# EasyEDA schematic wifi+lora_external.json
TITLE: Sheet_1; REV: 1.0; Date: 2025-01-19; Sheet: 1/1; Company: NotyCircuits
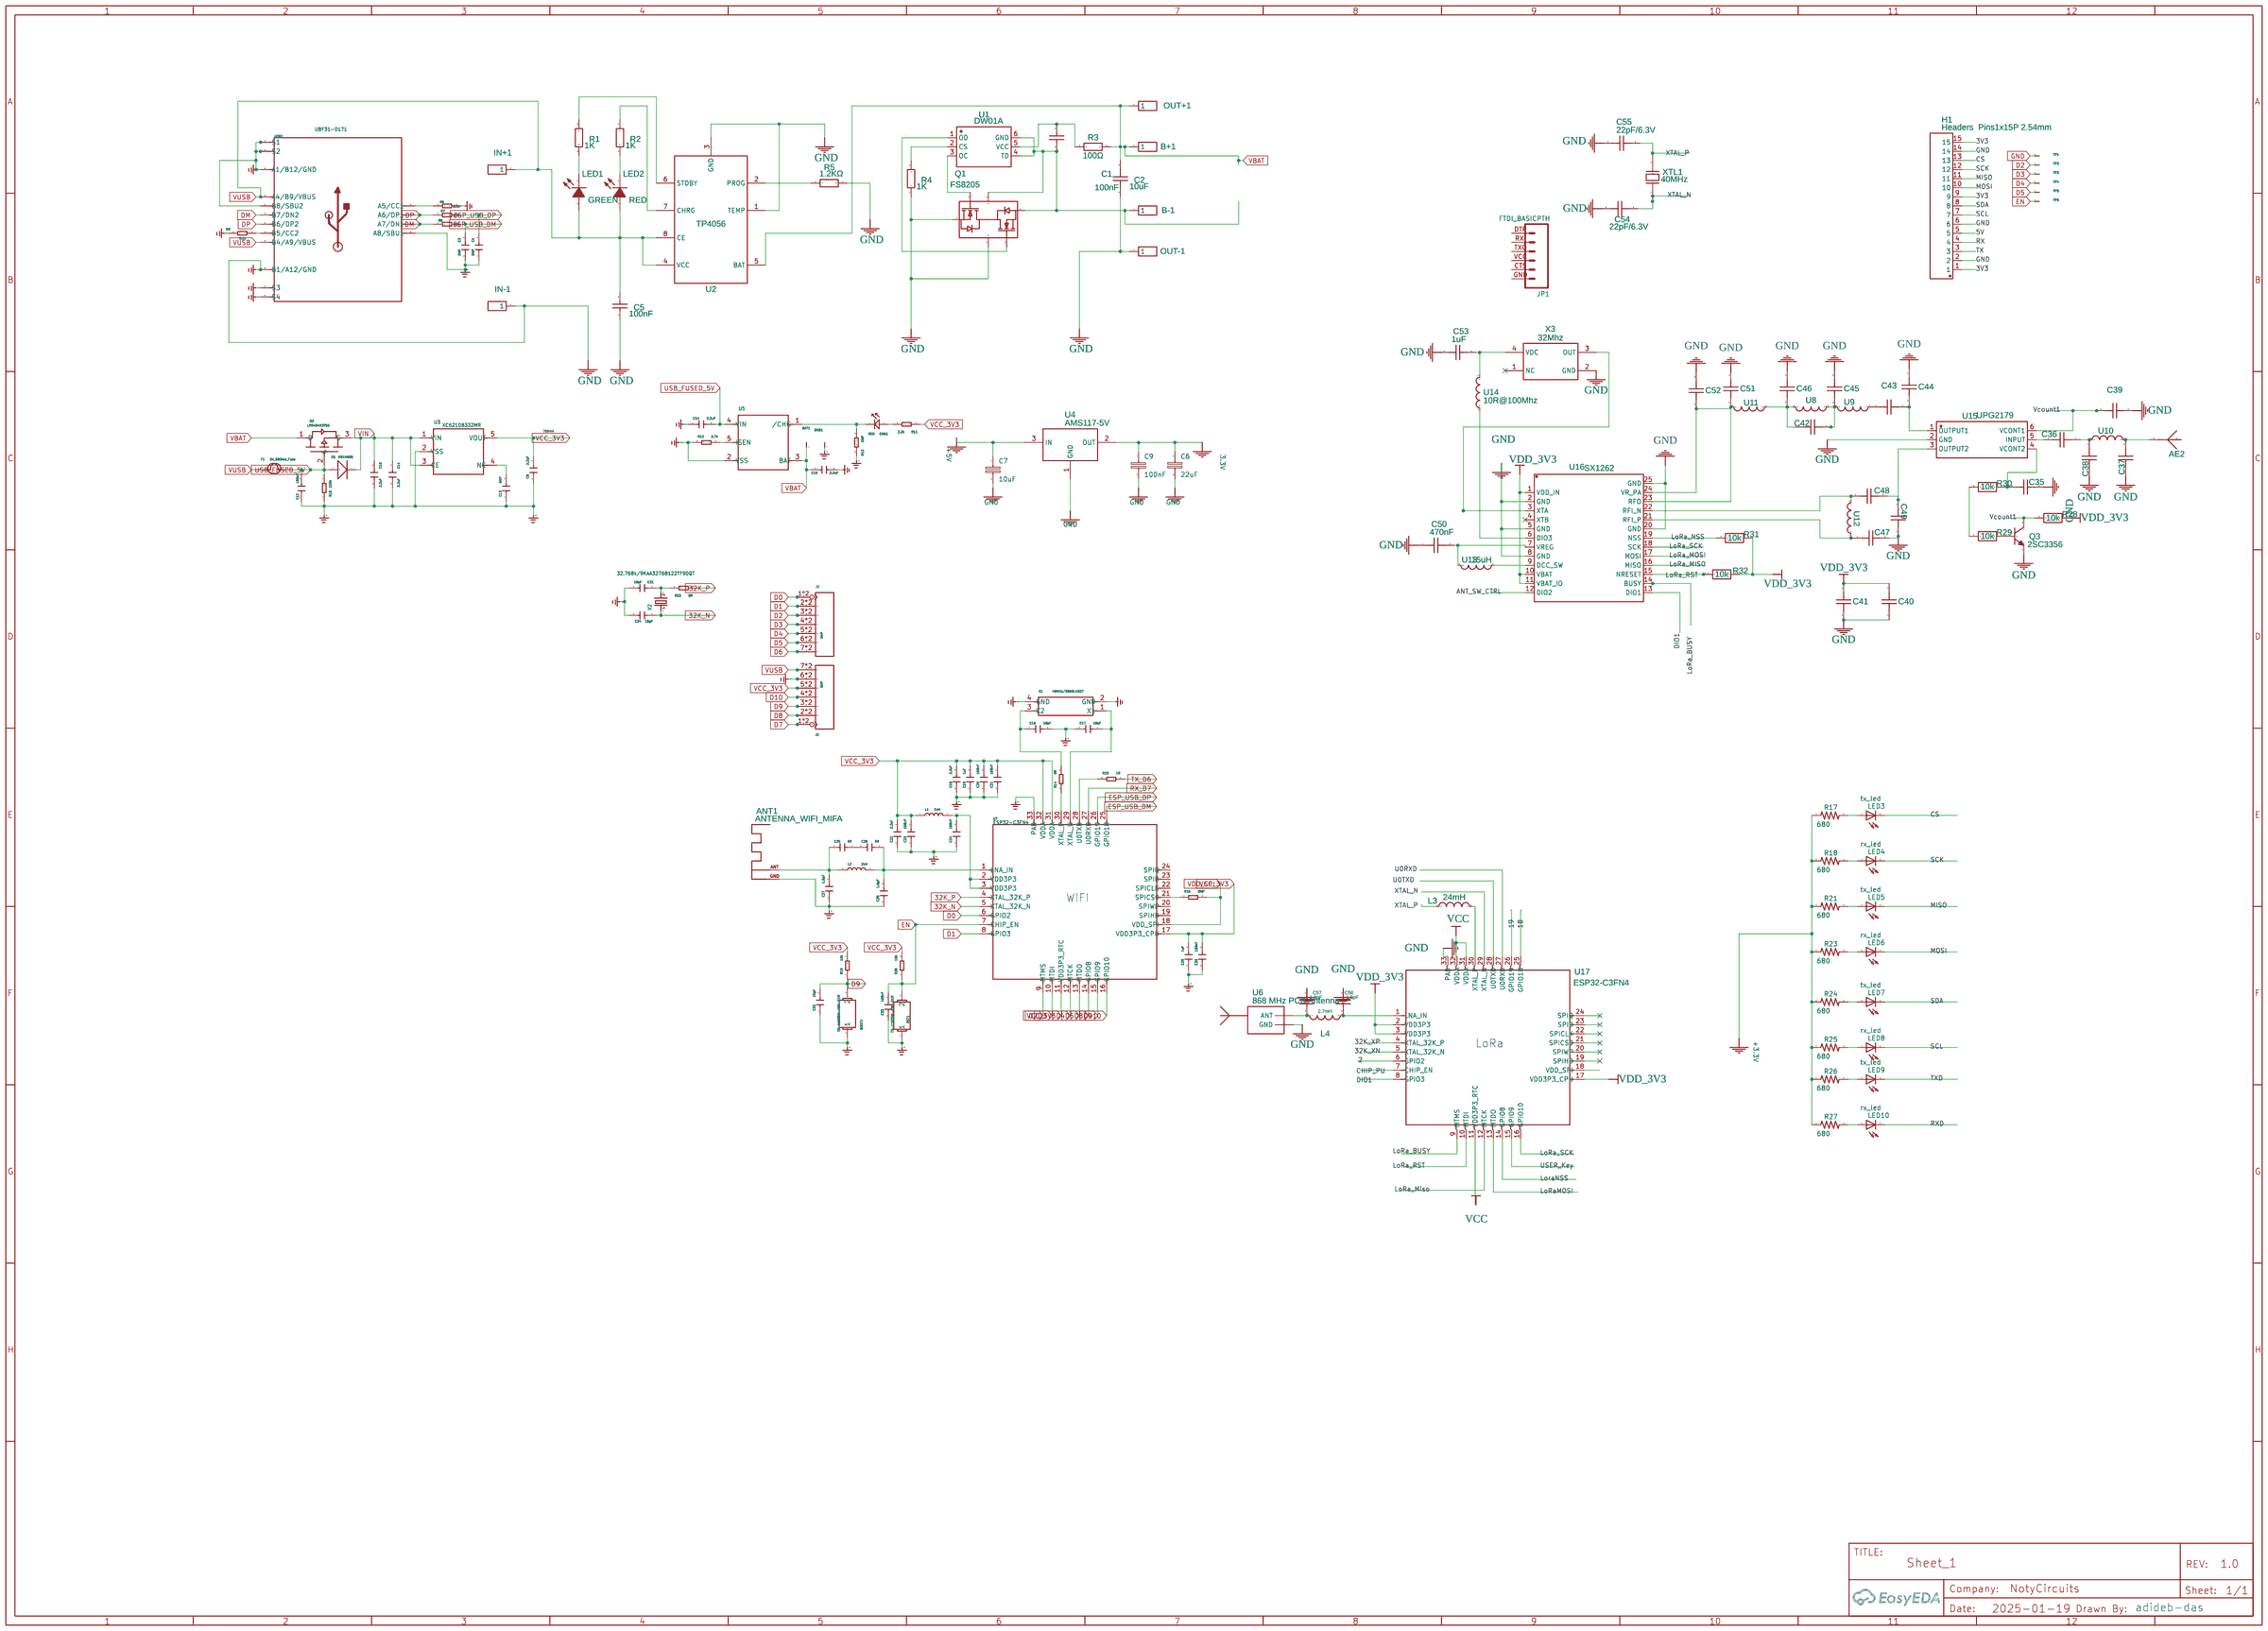
[diagram p0: schematic sheet]

## Parts
AE2  2450AT18A100E  [ANT-SMD_L3.2-W1.6]
ANT1  ANTENNA_WIFI_MIFA  [WIFI ANTENNA MIFA INVERTED F ANTENNA]
B+1  Header-Male-2.54_1x1  [HDR-1X1/2.54]
B-1  Header-Male-2.54_1x1  [HDR-1X1/2.54]
BAT1  DNP  [TP-80X40MIL]
BOOT1  TD-1183SN-A3N-D1R  [BUTTON_TD1183SA]
C1  100nF  [0603]
C2  10uF  [0603]
C3  DNP  [C0201]
C4  DNP  [C0201]
C5  100nF  [0603]
C6  22uF  [C3216]
C7  10uF  [C3216]
C8  2.2uF  [C0201]
C9  100nF  [0603-CAP]
C10  2.2uF  [C0201]
C11  2.2uF  [C0201]
C12  100nF  [C0201]
C13  DNP  [C0201]
C14  2.2uF  [C0201]
C15  2.2uF  [C0201]
C16  18pF  [C0201]
C17  18pF  [C0201]
C18  2.2uF  [C0201]
C19  1uF  [C0201]
C20  100nF  [C0201]
C21  100nF  [C0201]
C22  2.2uF  [C0201]
C23  100nF  [C0201]
C24  100nF  [C0201]
C25  0R  [C0201]
C26  0R  [C0201]
C27  1.6pF  [C0201]
C28  1.6pF  [C0201]
C29  1uF  [C0201]
C30  100nF  [C0201]
C31  18pF  [C0201]
C32  10pF  [C0201]
C33  100nF  [C0201]
C34  18pF  [C0201]
C35  1uF  [CAP-TH_L17.0-W8.5-P15.00-D1.2-FD]
C36  1uF  [CAP-TH_L17.0-W8.5-P15.00-D1.2-FD]
C37  1uF  [CAP-TH_L17.0-W8.5-P15.00-D1.2-FD]
C38  1uF  [CAP-TH_L17.0-W8.5-P15.00-D1.2-FD]
C39  1uF  [CAP-TH_L17.0-W8.5-P15.00-D1.2-FD]
C40  1uF  [CAP-TH_L17.0-W8.5-P15.00-D1.2-FD]
C41  1uF  [CAP-TH_L17.0-W8.5-P15.00-D1.2-FD]
C42  1uF  [CAP-TH_L17.0-W8.5-P15.00-D1.2-FD]
C43  1uF  [CAP-TH_L17.0-W8.5-P15.00-D1.2-FD]
C44  1uF  [CAP-TH_L17.0-W8.5-P15.00-D1.2-FD]
C45  1uF  [CAP-TH_L17.0-W8.5-P15.00-D1.2-FD]
C46  1uF  [CAP-TH_L17.0-W8.5-P15.00-D1.2-FD]
C47  1uF  [CAP-TH_L17.0-W8.5-P15.00-D1.2-FD]
C48  1uF  [CAP-TH_L17.0-W8.5-P15.00-D1.2-FD]
C49  1uF  [CAP-TH_L17.0-W8.5-P15.00-D1.2-FD]
C50  470nF  [CAP-TH_L17.0-W8.5-P15.00-D1.2-FD]
C51  1uF  [CAP-TH_L17.0-W8.5-P15.00-D1.2-FD]
C52  1uF  [CAP-TH_L17.0-W8.5-P15.00-D1.2-FD]
C53  1uF  [CAP-TH_L17.0-W8.5-P15.00-D1.2-FD]
C54  22pF/6.3V  [C0402]
C55  22pF/6.3V  [C0402]
C56  1.8pF  [C0402]
C57  1.8pF  [C0402]
CHG1  RED  [LED-0402]
D1  MSK4005  [SOD-523]
F1  6V_500mA_Fuse  [F0603]
G1  GND_POWER
G2  GND_POWER
G3  GND_POWER
G4  GND_POWER
G5  GND_POWER
G6  GND_POWER
G7  GND_POWER
G8  GND_POWER
G9  GND_POWER
G10  GND_POWER
G11  GND_POWER
G12  GND_POWER
G13  GND_POWER
G14  GND_POWER
G15  GND_POWER
G16  GND_POWER
G17  GND_POWER
G18  GND_POWER
G19  GND_POWER
G20  GND_POWER
G22  GND_POWER
G23  GND_POWER
G24  GND_POWER
G25  GND_POWER
G26  GND_POWER
G27  GND_POWER
GND1  DNP  [TP-80X40MIL]
H1  Headers  Pins1x15P 2.54mm  [HDR-TH_15P-P2.54-V-M]
IN+1  Header-Male-2.54_1x1  [HDR-1X1/2.54]
IN-1  Header-Male-2.54_1x1  [HDR-1X1/2.54]
J1  DNP  [H7-HALF-HOLE-2.54]
J2  DNP  [H7-HALF-HOLE-2.54]
JP1  FTDI_BASICPTH  [FTDI_BASIC]
L1  2nH  [L0201]
L2  2nH  [L0201]
L3  24mH  [INDUCTOR]
L4  2.7mH  [2.7MH SB3M]
LED1  GREEN  [LED-0603]
LED2  RED  [LED-0603]
LED3  tx_led  [CHIP-LED0805]
LED4  rx_led  [CHIP-LED0805]
LED5  tx_led  [CHIP-LED0805]
LED6  rx_led  [CHIP-LED0805]
LED7  tx_led  [CHIP-LED0805]
LED8  rx_led  [CHIP-LED0805]
LED9  tx_led  [CHIP-LED0805]
LED10  rx_led  [CHIP-LED0805]
OUT+1  Header-Male-2.54_1x1  [HDR-1X1/2.54]
OUT-1  Header-Male-2.54_1x1  [HDR-1X1/2.54]
Q1  FS8205  [SOT-23-6]
Q2  LP0404N3T5G  [PMOS_1.0*0.6*0.35MM]
Q3  2SC3356  [SOT-23-3_L2.9-W1.3-P1.90-LS2.4-BR-2]
R1  1K  [0603]
R2  1K  [0603]
R3  100Ω  [0603]
R4  1K  [0603]
R5  1.2KΩ  [0603]
R6  5.1k  [R0201]
R7  22R  [R0201]
R8  22R  [R0201]
R9  5.1k  [R0201]
R10  100k  [R0201]
R11  2.2k  [R0201]
R12  2.7k  [R0201]
R13  DNP  [R0201]
R14  0R  [R0201]
R15  1R  [R0201]
R16  DNP  [R0201]
R17  680  [0603-RES]
R18  680  [0603-RES]
R19  10k  [R0201]
R20  10k  [R0201]
R21  680  [0603-RES]
R22  0R  [R0201]
R23  680  [0603-RES]
R24  680  [0603-RES]
R25  680  [0603-RES]
R26  680  [0603-RES]
R27  680  [0603-RES]
R28  10k  [R0603]
R29  10k  [R0603]
R30  10k  [R0603]
R31  10k  [R0603]
R32  10k  [R0603]
RST1  TD-1183SN-A3N-D1R  [BUTTON_TD1183SA]
TP1  DNP  [TP-D45MIL]
TP2  DNP  [TP-D45MIL]
TP3  DNP  [TP-D45MIL]
TP4  DNP  [TP-D45MIL]
TP5  DNP  [TP-D45MIL]
TP6  DNP  [TP-D45MIL]
U1  DW01A  [SOT-23-6L]
U2  TP4056  [SOP-8_EP_150MIL]
U3  XC6210B332MR  [SOT-25]
U4  AMS117-5V  [AMS117-TOPL]
U5  PMIC-XC6802MR  [SOT-25]
U6  868 MHz PCB Antenna  [868MHZ_PCB_ANTENNA]
U7  ESP32-C3FN4  [QFN32G-0.5-5X5MM]
U8  15uH  [IND-SMD_L1.6-W1.0]
U9  15uH  [IND-SMD_L1.6-W1.0]
U10  15uH  [IND-SMD_L1.6-W1.0]
U11  15uH  [IND-SMD_L1.6-W1.0]
U12  15uH  [IND-SMD_L1.6-W1.0]
U13  15uH  [IND-SMD_L1.6-W1.0]
U14  10R@100Mhz  [IND-SMD_L1.6-W1.0]
U15  UPG2179  [SOT-363_L2.0-W1.3-P0.65-LS2.1-BL]
U16  SX1262  [QFN-24_L4.0-W4.0-P0.50-BL-EP2.6]
U17  ESP32-C3FN4  [QFN32G-0.5-5X5MM]
USB1  UBF31-0171  [USB2.0-TYPE-C]
X1  40MHz/306011037  [X4-SMD-2.0X1.6X0.5MM]
X2  32.768k/9KAA32768122TF90QT  [X2-SMD-1.6X1.0X0.5MM]
X3  32Mhz  [40MHZ CRYSTAL OSCILLATOR]
XTL1  40MHz  [16MHZ CRYSTAL]

## Library data of the parts
AE2 = 2450AT18A100E: Contributor: LCSC; Supplier: LCSC; Supplier Part: C89334; Manufacturer: JOHANSON(约翰逊); JLCPCB Part Class: Extended Part
ANT1 = ANTENNA_WIFI_MIFA: Contributor: Joshua Lloyd
B+1 B-1 IN+1 IN-1 OUT+1 OUT-1 = -: Supplier Part: C81276; Supplier: LCSC; Manufacturer: ReliaPro
C1 C5 = 0603B104K250: Supplier: LCSC; Manufacturer: WTC; Supplier Part: C83054
C2 = CL10A106MP8NNNC: Supplier: LCSC; Manufacturer: SAMSUNG; Supplier Part: C85713
C35-C53 = 1uf/250V/CBBCapacitor: Supplier Part: C29321; Supplier: LCSC; Manufacturer: ReliaPro; JLCPCB Part Class: Extended Part
C54 C55 = 22PF/6.3V(10%)-0402: Contributor: LCSC; Supplier: LCSC; Supplier Part: C9900004403; Manufacturer: null; Manufacturer Part: 22pF/6.3V(10%)-0402; JLCPCB Part Class: Extended Part
C56 = GJM1555C1H1R8BB01D: Supplier: LCSC; Manufacturer: muRata(村田); Supplier Part: C76902; JLCPCB Part Class: Extended Part
C57 = GJM1555C1H1R8BB01D: Supplier: LCSC; Manufacturer: muRata(村田); Supplier Part: C76902; JLCPCB Part Class: Extended Part; Package Display: No
H1 = Headers  Pins1x15P 2.54mm: Supplier Part: C54102; Supplier: LCSC; Manufacturer: null; Manufacturer Part: 排针1x15P 2.54mm; JLCPCB Part Class: Extended Part
L3 = Inductor TH: Manufacturer: ML; Supplier Part: C46030; LCSC Assembly: Yes; SMT Type: Extend; Paste Type: expand; Contributor: Blueblood
L4 = 2.7mH sb3m: Contributor: hisound
LED1 = -: Supplier: LCSC; Manufacturer: LITEON; Manufacturer Part: LTST-C193TGKT-5A; Supplier Part: C12065
LED2 = -: Supplier: LCSC; Manufacturer: LITEON; Manufacturer Part: LTST-C191KRKT; Contributor: LCSC; Supplier Part: C125099
Q1 = -: Supplier: LCSC; Manufacturer: FORTUNE; LCSC Assembly: Yes; image: //image.lceda.cn/szlcsc/C32254.jpg; Supplier Part: C32254
Q3 = 2SC3356_C5119709: Contributor: lcsc; Supplier: LCSC; Supplier Part: C5119709; Manufacturer: FOSAN(富信)
R1 R2 R4 = ERJ3GEYJ102V: Supplier: LCSC; Manufacturer: PANASONIC; Contributor: LCSC; Supplier Part: C180848
R3 = 0603WAJ0101T5E: Supplier: LCSC; Manufacturer: UniOhm; Supplier Part: C25201
R5 = RC0603JR-071K2L: Supplier: LCSC; Manufacturer: YAGEO; Supplier Part: C114679
R28-R32 = 贴片电阻CHIPRESISTORS: Contributor: lcsc; Supplier: LCSC; Supplier Part: C9900014833; Manufacturer: null; Manufacturer Part: 贴片电阻ChipResistors; JLCPCB Part Class: Extended Part
U1 = -: Supplier: LCSC; Manufacturer: PUOLOP; Contributor: LCSC; Supplier Part: C351410
U2 = -: Contributor: Guest; Supplier: LCSC; Manufacturer: TOPPOWER; LCSC Assembly: Yes; image: //image.lceda.cn/szlcsc/C16581.jpg; Supplier Part: C16581
U4 = AMS117: Contributor: Achmad Purnomo
U6 = 868 MHz PCB Antenna: Contributor: mKenfenheuer
U8-U14 = 10UH-INDUCTOR-0603: Contributor: lcsc; Supplier: LCSC; Supplier Part: C9900016650; Manufacturer: null; Manufacturer Part: 10uH-INDUCTOR-0603; JLCPCB Part Class: Extended Part
U15 = UPG2179TB-E4-A: Contributor: lcsc; Supplier: LCSC; Supplier Part: C3312585; Manufacturer: RENESAS(瑞萨)/IDT; JLCPCB Part Class: Extended Part
U16 = SX1262IMLTRT: Contributor: LCSC; Supplier: LCSC; Supplier Part: C191341; Manufacturer: SEMTECH; JLCPCB Part Class: Extended Part
U17 = ESP32-C3FN4: Contributor: ruchika.3pvisionx
X3 = OSC40M-3.3/S5: Manufacturer: YIC; link: https://www.tme.eu/Document/456c7b2975a812de7905406dd4f750d9/YIC-S5.pdf; Contributor: rabirland
XTL1 = XTL - 16MHZ: Manufacturer Part: NTPL INSIDE; Contributor: athutony280402

## Nets
3.3V: C6.1 C9.1 U4.2(OUT)
3V3: H1.1 H1.9 H1.15
5V: H1.5
+3.3V: R17.1 R18.1 R21.1 R23.1 R24.1 R25.1 R26.1 R27.1
+5V: C7.1 U4.3(IN)
GND: C2.1 C5.1 C6.2 C7.2 C9.2 C35.1 C37.1 C38.1 C39.1 C40.1 C41.2 C44.1 C45.1 C46.1 C47.2 C49.1 C50.1 C52.1 C54.1 C55.1 C56.1 C57.1 G4.(GND) H1.2 H1.6 H1.14 IN-1.1 OUT-1.1 Q1.1(S1) Q1.5(D12) Q3.1(E) R4.1 R5.2 TP1.T U2.1(TEMP) U2.3(GND) U4.1(GND) U6.GND U15.2(GND) U16.2(GND) U16.5(GND) U16.8(GND) U16.20(GND) U16.25(GND) U17.33(PAD) USB1.B1_A12(B1/A12/GND) X3.2(GND)
VBAT: B+1.1 BAT1.1(T) C2.2 C15.1 OUT+1.1 Q2.1(D) R3.2 U2.5(BAT) U5.3(BAT)
VCC: U17.11(VDD3P3_RTC) U17.31(VDDA) U17.32(VDDA)
VCC_3V3: C8.2 C18.2 C19.2 C20.2 C21.2 C22.2 C23.2 C29.2 C30.2 J2.5*2(5) J2.17(5) L1.1 R11.1 R19.2 R20.2 U3.5(VOUT) U7.11(VDD3P3_RTC) U7.17(VDD3P3_CPU) U7.31(VDDA) U7.32(VDDA)
VDD_3V3: C40.2 C41.1 R28.2 R31.2 R32.2 U16.1(VDD_IN) U16.10(VBAT) U16.11(VBAT_IO) U17.2(VDD3P3) U17.3(VDD3P3) U17.17(VDD3P3_CPU)
VDD_SPI: R16.2 U7.18(VDD_SPI)
VIN: C10.1 C11.1 D1.- Q2.3(S) U3.1(VIN) U3.3(CE)
2: U17.6(GPIO2)
32K_N: C34.1 U7.5(XTAL_32K_N) X2.1
32K_P: R22.1 U7.4(XTAL_32K_P)
CS: H1.13 LED3.C
D0: J1.1*2(1) J1.13(1) U7.6(GPIO2)
D1: J1.2*2(2) J1.14(2) U7.8(GPIO3)
D2: J1.3*2(3) J1.15(3) TP2.T U7.9(MTMS)
D3: J1.4*2(4) J1.16(4) TP3.T U7.10(MTDI)
D4: J1.5*2(5) J1.17(5) TP4.T U7.12(MTCK)
D5: J1.6*2(6) J1.18(6) TP5.T U7.13(MTDO)
D6: J1.7*2(7) J1.19(7)
D7: J2.1*2(1) J2.13(1)
D8: J2.2*2(2) J2.14(2) U7.14(GPIO8)
D9: BOOT1.2 C32.2 J2.3*2(3) J2.15(3) R19.1 U7.15(GPIO9)
D10: J2.4*2(4) J2.16(4) U7.16(GPIO10)
DM: R8.1 USB1.A7(A7/DN1) USB1.B7(B7/DN2)
DP: R7.1 USB1.A6(A6/DP1) USB1.B6(B6/DP2)
EN: C33.2 R20.1 RST1.2 TP6.T U7.7(CHIP_EN)
ESP_USB_DM: C3.2 R8.2 U7.25(GPIO18)
ESP_USB_DP: C4.2 R7.2 U7.26(GPIO19)
LoRa_MISO: U16.16(MISO)
LoRa_MOSI: U16.17(MOSI)
LoRa_NSS: R31.1 U16.19(NSS)
LoRa_SCK: U16.18(SCK) U17.16(GPIO10)
LoRaMOSI: U17.13(MTDO)
LoraNSS: U17.14(GPIO8)
MISO: H1.11 LED5.C
MOSI: H1.10 LED6.C
RX: H1.4
RX_D7: U7.27(U0RXD)
RXD: LED10.C
SCK: H1.12 LED4.C
SCL: H1.7 LED8.C
SDA: H1.8 LED7.C
TX: H1.3
TX_D6: R15.1
TXD: LED9.C
USB_FUSED_5V: C12.2 C14.2 D1.+ F1.2 Q2.2(G) R10.2 U5.4(VIN)
USER_Key: U17.15(GPIO9)
VUSB: C5.2 F1.1 IN+1.1 J2.7*2(7) J2.19(7) LED1.1(A) LED2.1(A) U2.4(VCC) U2.8(CE) USB1.A4_B9(A4/B9/VBUS) USB1.B4_A9(B4/A9/VBUS)
XTAL_N: C54.2 XTL1.1
Net-(AE2-1): AE2.1(ANT) C37.2 U10.2
Net-(ANT1-ANT): ANT1.ANT C25.2 C27.2 L2.1
Net-(ANT1-GND): ANT1.GND C27.1 C28.1 G22.(GND)
Net-(B-1-1): B-1.1 C1.2 Q1.2(D12) Q1.3(S2) U1.4(TD) U1.6(GND)
Net-(BOOT1-1): BOOT1.1 C32.1 G25.(GND)
Net-(C1-1): C1.1 R3.1 U1.5(VCC)
Net-(C3-1): C3.1 C4.1 G5.(GND) USB1.A8(A8/SBU1)
Net-(C8-1): C8.1 C10.2 C11.2 C12.1 C13.1 G10.(GND) G11.(GND) R10.1 U3.2(VSS)
Net-(C13-2): C13.2 U3.4(NC)
Net-(C14-1): C14.1 G8.(GND)
Net-(C15-2): C15.2 G14.(GND)
Net-(C16-1): C16.1 R14.2 X1.3(X2)
Net-(C16-2): C16.2 C17.2 G17.(GND)
Net-(C17-1): C17.1 U7.29(XTAL_N) X1.1(X1)
Net-(C18-1): C18.1 C19.1 C20.1 C21.1 G18.(GND)
Net-(C22-1): C22.1 C23.1 C24.1 G20.(GND)
Net-(C24-2): C24.2 L1.2 U7.2(VDD3P3) U7.3(VDD3P3)
Net-(C25-1): C25.1 C26.2
Net-(C26-1): C26.1 C28.2 L2.2 U7.1(LNA_IN)
Net-(C29-1): C29.1 C30.1 G23.(GND)
Net-(C31-1): C31.1 R22.2 X2.2
Net-(C31-2): C31.2 C34.2 G24.(GND)
Net-(C33-1): C33.1 G26.(GND) RST1.1
Net-(C35-2): C35.2 R30.2 U15.4(VCONT2)
Net-(C36-1): C36.1 C38.2 U10.1
Net-(C36-2): C36.2 U15.5(INPUT)
Net-(C39-2): C39.2 U15.6(VCONT1)
Net-(C42-1): C42.1 C45.2 U8.1 U9.2
Net-(C42-2): C42.2 C46.2 U8.2 U11.1
Net-(C43-1): C43.1 C44.2 U15.1(OUTPUT1)
Net-(C43-2): C43.2 U9.1
Net-(C47-1): C47.1 U12.1 U16.21(RFI_P)
Net-(C48-1): C48.1 U12.2 U16.22(RFI_N)
Net-(C48-2): C48.2 C49.2 U15.3(OUTPUT2)
Net-(C50-2): C50.2 U13.2 U16.7(VREG)
Net-(C51-2): C51.2 C52.2 U11.2 U16.23(RFO) U16.24(VR_PA)
Net-(C53-2): C53.2 U14.2 X3.4(VDC)
Net-(C55-2): C55.2 XTL1.2
Net-(C56-2): C56.2 L4.2 U17.1(LNA_IN)
Net-(C57-2): C57.2 L4.1 U6.ANT
Net-(CHG1-+): CHG1.+ R11.2
Net-(CHG1--): CHG1.- R13.1 U5.1(/CHG)
Net-(G1-): G1.(GND) USB1.A1_B12(A1/B12/GND) USB1.B8(B8/SBU2) USB1.S1 USB1.S2 USB1.S5(S1) USB1.S6(S2)
Net-(G2-): G2.(GND) R6.2
Net-(G3-): G3.(GND) R9.1
Net-(G6-): G6.(GND) USB1.S3
Net-(G7-): G7.(GND) USB1.S4
Net-(G9-): G9.(GND) R12.2 U5.2(VSS)
Net-(G12-): G12.(GND) GND1.1(T)
Net-(G13-): G13.(GND) R13.2
Net-(G15-): G15.(GND) X1.4(GND)
Net-(G16-): G16.(GND) X1.2(GND)
Net-(G19-): G19.(GND) U7.33(PAD)
Net-(G27-): G27.(GND) J2.6*2(6) J2.18(6)
Net-(L3-2): L3.2 U17.30(XTAL_P)
Net-(LED1-2): LED1.2(K) R1.1
Net-(LED2-2): LED2.2(K) R2.2
Net-(LED3-A): LED3.A R17.2
Net-(LED4-A): LED4.A R18.2
Net-(LED5-A): LED5.A R21.2
Net-(LED6-A): LED6.A R23.2
Net-(LED7-A): LED7.A R24.2
Net-(LED8-A): LED8.A R25.2
Net-(LED9-A): LED9.A R26.2
Net-(LED10-A): LED10.A R27.2
Net-(Q1-4): Q1.4(G2) U1.1(OD)
Net-(Q1-6): Q1.6(G1) U1.3(OC)
Net-(Q3-2): Q3.2(B) R29.2
Net-(Q3-3): Q3.3(C) R28.1
Net-(R1-2): R1.2 U2.6(STDBY)
Net-(R2-1): R2.1 U2.7(CHRG)
Net-(R4-2): R4.2 U1.2(CS)
Net-(R5-1): R5.1 U2.2(PROG)
Net-(R6-1): R6.1 USB1.A5(A5/CC1)
Net-(R9-2): R9.2 USB1.B5(B5/CC2)
Net-(R12-1): R12.1 U5.5(ISEN)
Net-(R14-1): R14.1 U7.30(XTAL_P)
Net-(R15-2): R15.2 U7.28(U0TXD)
Net-(R16-1): R16.1 U7.21(SPICS0)
Net-(R29-1): R29.1 R30.1
Net-(R32-1): R32.1 U16.15(NRESET)
Net-(U13-1): U13.1 U16.9(DCC_SW)
Net-(U14-1): U14.1 U16.6(DIO3)
Net-(U16-3): U16.3(XTA) X3.3(OUT)

Not connected (* = marked no-connect by the designer): AE2 2; C51 1; C53 1; JP1 CTS(5) DTR(1) GND(6) RXI(2) TXO(3) VCC(4); L3 1; U7 19(SPIHD) 20(SPIWP) 22(SPICLK) 23(SPID) 24(SPIQ); U16 4(XTB)* 12(DIO2) 13(DIO1) 14(BUSY); U17 4(XTAL_32K_P) 5(XTAL_32K_N) 7(CHIP_EN) 8(GPIO3) 9(MTMS) 10(MTDI) 12(MTCK) 18(VDD_SPI) 19(SPIHD) 20(SPIWP) 21(SPICS0) 22(SPICLK) 23(SPID) 24(SPIQ) 25(GPIO18) 26(GPIO19) 27(U0RXD) 28(U0TXD) 29(XTAL_N); X3 1(NC)*

## Notes on the sheet
- 700mA
- WIFI
- LoRa
- adideb-das
